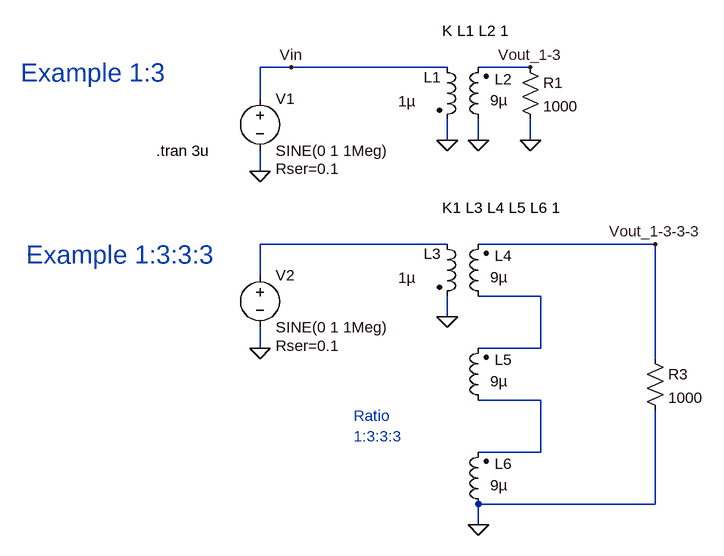
[diagram p0: schematic Transfomer-step-up-1-3-or-1-3-3-3.asc]
Transfomer-step-up-1-3-or-1-3-3-3.asc, the LTspice schematic file:
Version 4.1
SHEET 1 880 756
WIRE -48 32 -96 32
WIRE 192 32 -48 32
WIRE 320 32 240 32
WIRE -96 80 -96 32
WIRE 192 144 192 112
WIRE 240 144 240 112
WIRE 320 144 320 112
WIRE -96 192 -96 160
WIRE 192 304 -96 304
WIRE 512 304 240 304
WIRE -96 352 -96 304
WIRE 336 384 240 384
WIRE 192 416 192 384
WIRE -96 464 -96 432
WIRE 336 464 336 384
WIRE 336 464 240 464
WIRE 512 480 512 304
WIRE 336 544 240 544
WIRE 336 624 336 544
WIRE 336 624 240 624
WIRE 512 704 512 560
WIRE 512 704 240 704
WIRE 240 736 240 704
FLAG -96 192 0
FLAG 192 144 0
FLAG 320 144 0
FLAG 240 144 0
FLAG -96 464 0
FLAG 192 416 0
FLAG 240 736 0
FLAG -48 32 Vin
FLAG 320 32 Vout_1-3
FLAG 512 304 Vout_1-3-3-3
SYMBOL voltage -96 64 R0
WINDOW 123 0 0 Left 0
WINDOW 39 24 124 Left 2
SYMATTR InstName V1
SYMATTR Value SINE(0 1 1Meg)
SYMATTR SpiceLine Rser=0.1
SYMBOL ind2 176 16 R0
WINDOW 0 -20 31 Left 2
WINDOW 3 -59 68 Left 2
SYMATTR InstName L1
SYMATTR Value 1µ
SYMBOL ind2 256 128 R180
WINDOW 0 -36 78 Left 2
WINDOW 3 -29 45 Left 2
SYMATTR InstName L2
SYMATTR Value 9µ
SYMBOL res 304 16 R0
SYMATTR InstName R1
SYMATTR Value 1000
SYMBOL voltage -96 336 R0
WINDOW 123 0 0 Left 0
WINDOW 39 24 124 Left 2
SYMATTR InstName V2
SYMATTR Value SINE(0 1 1Meg)
SYMATTR SpiceLine Rser=0.1
SYMBOL ind2 176 288 R0
WINDOW 0 -20 31 Left 2
WINDOW 3 -59 68 Left 2
SYMATTR InstName L3
SYMATTR Value 1µ
SYMATTR SpiceLine Rser=100m
SYMBOL ind2 256 400 R180
WINDOW 0 -36 78 Left 2
WINDOW 3 -29 45 Left 2
SYMATTR InstName L4
SYMATTR Value 9µ
SYMATTR SpiceLine Rser=15m
SYMBOL ind2 256 560 R180
WINDOW 0 -36 78 Left 2
WINDOW 3 -29 45 Left 2
SYMATTR InstName L5
SYMATTR Value 9µ
SYMATTR SpiceLine Rser=15m
SYMBOL res 496 464 R0
SYMATTR InstName R3
SYMATTR Value 1000
SYMBOL ind2 256 720 R180
WINDOW 0 -36 78 Left 2
WINDOW 3 -29 45 Left 2
SYMATTR InstName L6
SYMATTR Value 9µ
SYMATTR SpiceLine Rser=15m
TEXT -256 160 Left 2 !.tran 3u
TEXT 184 -24 Left 2 !K L1 L2 1
TEXT 184 248 Left 2 !K1 L3 L4 L5 L6 1
TEXT 48 568 Left 2 ;Ratio\n1:3:3:3
TEXT -464 40 Left 4 ;Example 1:3
TEXT -456 320 Left 4 ;Example 1:3:3:3

The netlist it stands for:
* Transfomer-step-up-1-3-or-1-3-3-3.asc
V1 Vin 0 SINE(0 1 1Meg) Rser=0.1
L1 Vin 0 1µ
L2 0 Vout_1-3 9µ
R1 Vout_1-3 0 1000
V2 N001 0 SINE(0 1 1Meg) Rser=0.1
L3 N001 0 1µ Rser=100m
L4 N002 Vout_1-3-3-3 9µ Rser=15m
L5 N003 N002 9µ Rser=15m
R3 Vout_1-3-3-3 0 1000
L6 0 N003 9µ Rser=15m
.tran 3u
K L1 L2 1
K1 L3 L4 L5 L6 1
* Ratio
* 1:3:3:3
* Example 1:3
* Example 1:3:3:3
.backanno
.end